# EAGLE design lcdboard (EAGLE 5.07)
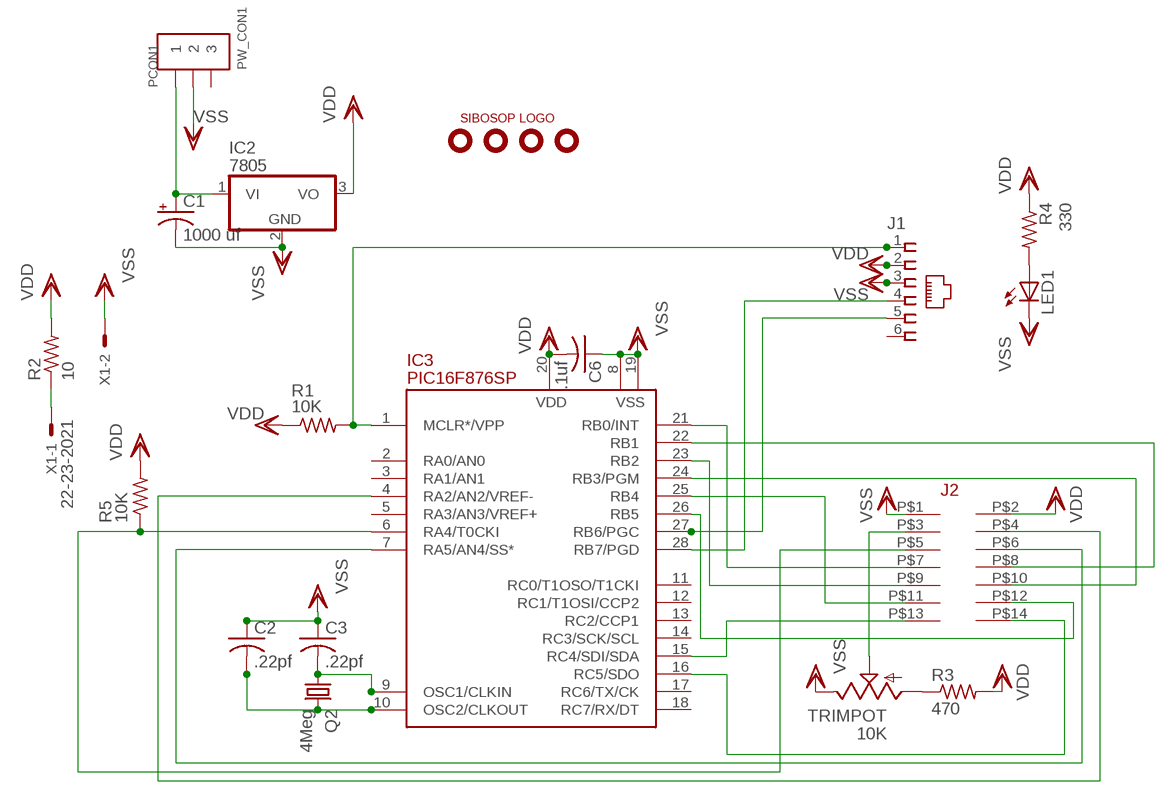
[diagram p0: schematic, sheet 1]

## Parts
10K  TRIMPOT  [RJ6S]
C1  1000 uf  CPOL-USE3.5-10  [E3,5-10]
C2  .22pf  C-US025-024X044  [C025-024X044]
C3  .22pf  C-US025-024X044  [C025-024X044]
C6  .1uf  C-US025-024X044  [C025-024X044]
IC2  7805  [TO220V]
IC3  PIC16F876SP  [DIL28-3]
J1  520250-3  [520250-3]
J2  CON-RIBBON-14  [CON-RIBBON-14]
LED1  LEDSQR2X5  [LED2X5]
PCON1  PW_CON1  [PW_CON1]
Q2  4Meg  CRYSTALHC49S  [HC49/S]
R1  10K  R-US_0204/2V  [0204V]
R2  10  R-US_0207/10  [0207/10]
R3  470  R-US_0204/7  [0204/7]
R4  330  R-US_0204/2V  [0204V]
R5  10K  R-US_0204/2V  [0204V]
U$1  HOLE-125  [HOLE-125]
U$2  HOLE-125  [HOLE-125]
U$3  LOGO  [LOGO]
U$5  HOLE-125  [HOLE-125]
U$7  HOLE-125  [HOLE-125]
X1  22-23-2021  [22-23-2021]

## Nets
N$1: IC3.1(MCLR*/VPP) J1.1 R1.2
N$2: C1.+ IC2.1(VI) PCON1.P$1
N$3: C2.2 IC3.10(OSC2/CLKOUT) Q2.2
N$4: C3.2 IC3.9(OSC1/CLKIN) Q2.1
N$5: R2.1 X1.1
N$6: 10K.A R3.1
N$7: 10K.S J2.P$3
N$8: IC3.4(RA2/AN2/VREF-) J2.P$4
N$9: IC3.6(RA4/T0CKI) J2.P$5 R5.1
N$10: IC3.7(RA5/AN4/SS*) J2.P$6
N$11: IC3.21(RB0/INT) J2.P$7
N$12: IC3.22(RB1) J2.P$8
N$13: IC3.23(RB2) J2.P$9
N$14: IC3.27(RB6/PGC) J1.5
N$15: IC3.24(RB3/PGM) J2.P$10
N$16: IC3.25(RB4) J2.P$11
N$17: IC3.26(RB5) J2.P$12
N$18: IC3.15(RC4/SDI/SDA) J2.P$13
N$19: IC3.16(RC5/SDO) J2.P$14
N$21: IC3.28(RB7/PGD) J1.4
N$22: LED1.A R4.2
VDD: C6.2 IC2.3(VO) IC3.20(VDD) J1.2 J2.P$2 R1.1 R2.2 R3.2 R4.1 R5.2
VSS: 10K.E C1.- C2.1 C3.1 C6.1 IC2.2(GND) IC3.8(VSS) IC3.19(VSS) J1.3 J2.P$1 LED1.K(C) PCON1.P$2 X1.2
Unconnected: IC3.2(RA0/AN0) IC3.3(RA1/AN1) IC3.5(RA3/AN3/VREF+) IC3.11(RC0/T1OSO/T1CKI) IC3.12(RC1/T1OSI/CCP2) IC3.13(RC2/CCP1) IC3.14(RC3/SCK/SCL) IC3.17(RC6/TX/CK) IC3.18(RC7/RX/DT) J1.6 PCON1.P$3

## Library data of the parts
10K = sibosop:TRIMPOT
C1 = rcl:CPOL-US: POLARIZED CAPACITOR, American symbol
C2 C3 C6 = rcl:C-US: CAPACITOR, American symbol
IC2 = kmarx1:78*: 78xx Family - Positive voltage regulator
IC3 = pic16f87x:PIC16F876: FLASH MICROCONTROLLER
J1 = con-amp:520250-3: AMP connector
J2 = sibosop:CON-RIBBON-14
LED1 = led:LED: LED OSRAM: - CHIPLED LG R971, LG N971, LY N971, LG Q971, LY Q971, LO R971, LY R971 LH N974, LH R974 LS Q976, LO Q976, LY Q976 LO Q996 - Hyper CHIPLED LW Q18S LB Q993, LB Q99A, LB R99A - SideLED LS A670, LO A670, LY A670, LG A670, LP A670 LB A673, LV A673, LT A673, LW A673 LH A674 LY A675 LS A676, LA A676, LO A676, LY A676, LW A676 LS A679, LY A679, LG A679 - Hyper Micro SIDELED® LS Y876, LA Y876, LO Y876, LY Y876 LT Y87S - SmartLED LW L88C, LW L88S LB L89C, LB L89S, LG L890 LS L89K, LO L89K, LY L89K LS L896, LA L896, LO L896, LY L896 - TOPLED LS T670, LO T670, LY T670, LG T670, LP T670 LSG T670, LSP T670, LSY T670, LOP T670, LYG T670 LG T671, LOG T671, LSG T671 LB T673, LV T673, LT T673, LW T673 LH T674 LS T676, LA T676, LO T676, LY T676, LB T676, LH T676, LSB T676, LW T676 LB T67C, LV T67C, LT T67C, LS T67K, LO T67K, LY T67K, LW E67C LS E67B, LA E67B, LO E67B, LY E67B, LB E67C, LV E67C, LT E67C LW T67C LS T679, LY T679, LG T679 LS T770, LO T770, LY T770, LG T770, LP T770 LB T773, LV T773, LT T773, LW T773 LH T774 LS E675, LA E675, LY E675, LS T675 LS T776, LA T776, LO T776, LY T776, LB T776 LHGB T686 LT T68C, LB T68C - Hyper Mini TOPLED® LB M676 - Mini TOPLED Santana® LG M470 LS M47K, LO M47K, LY M47K Source: http://www.osram.convergy.de - LUMILED® LXK2-PW12-R00, LXK2-PW12-S00, LXK2-PW14-U00, LXK2-PW14-V00 LXK2-PM12-R00, LXK2-PM12-S00, LXK2-PM14-U00 LXK2-PE12-Q00, LXK2-PE12-R00, LXK2-PE12-S00, LXK2-PE14-T00, LXK2-PE14-U00 LXK2-PB12-K00, LXK2-PB12-L00, LXK2-PB12-M00, LXK2-PB14-N00, LXK2-PB14-P00, LXK2-PB14-Q00 LXK2-PR12-L00, LXK2-PR12-M00, LXK2-PR14-Q00, LXK2-PR14-R00 LXK2-PD12-Q00, LXK2-PD12-R00, LXK2-PD12-S00 LXK2-PH12-R00, LXK2-PH12-S00 LXK2-PL12-P00, LXK2-PL12-Q00, LXK2-PL12-R00 Source: www.luxeon.com
PCON1 = powerconnectorskt:PW_CON1
Q2 = crystal:CRYSTAL: CRYSTAL
R1-R5 = rcl:R-US_: RESISTOR, American symbol
U$1 U$2 U$5 U$7 = sibosop:HOLE-125
U$3 = sibosop:LOGO
X1 = sibosop-con-molex:22-23-2021: .100" (2.54mm) Center Header - 2 Pin

## Board
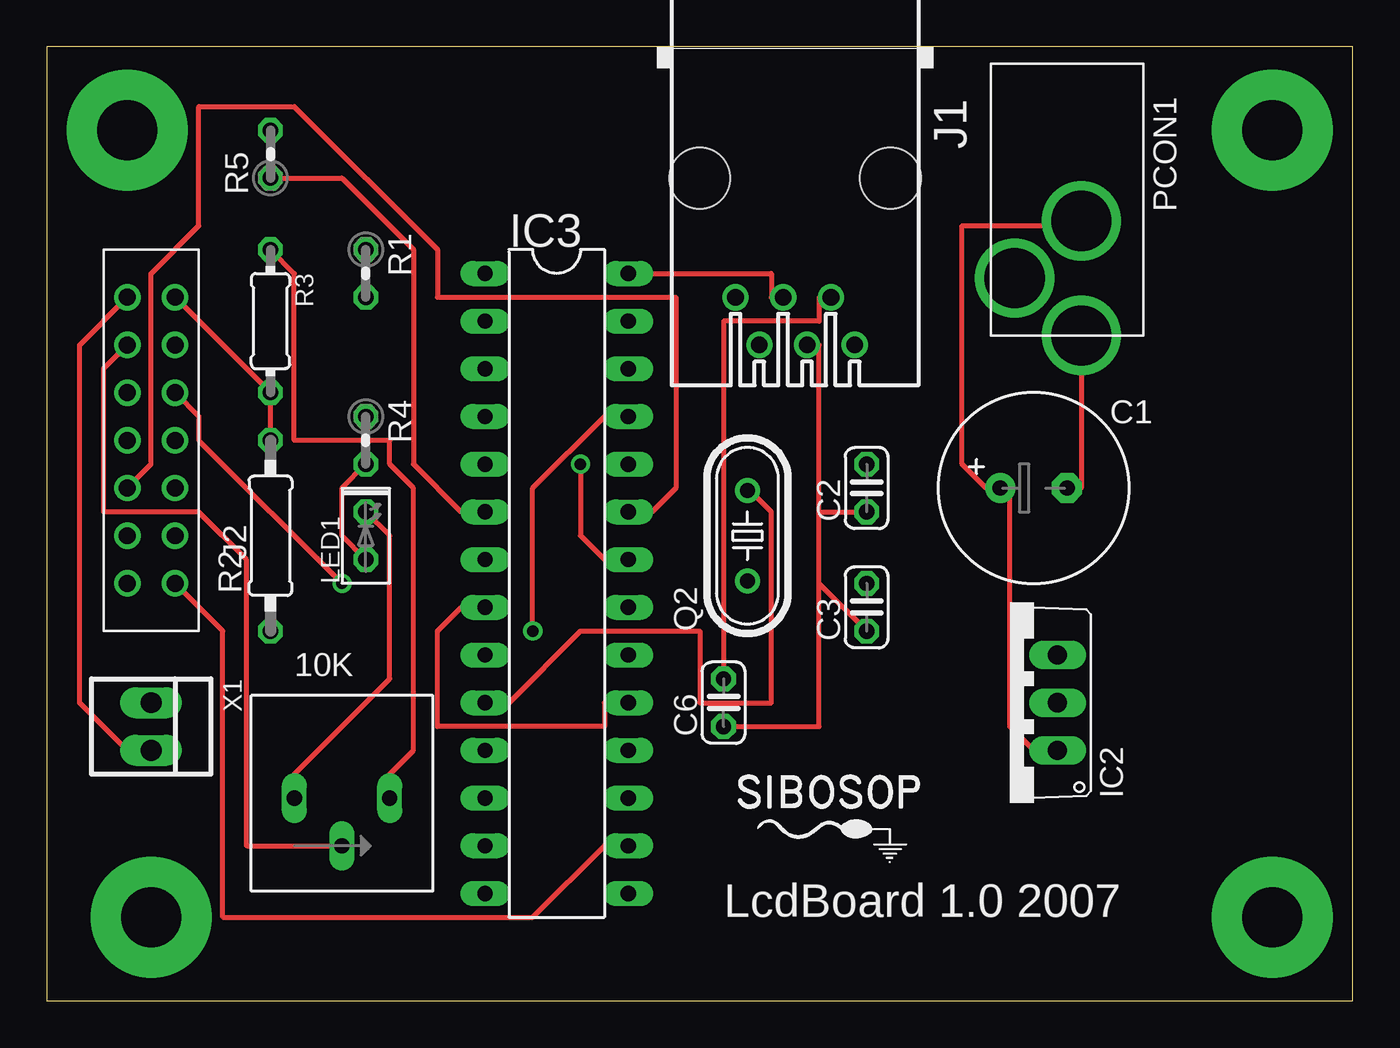
[diagram p1: board, top side]
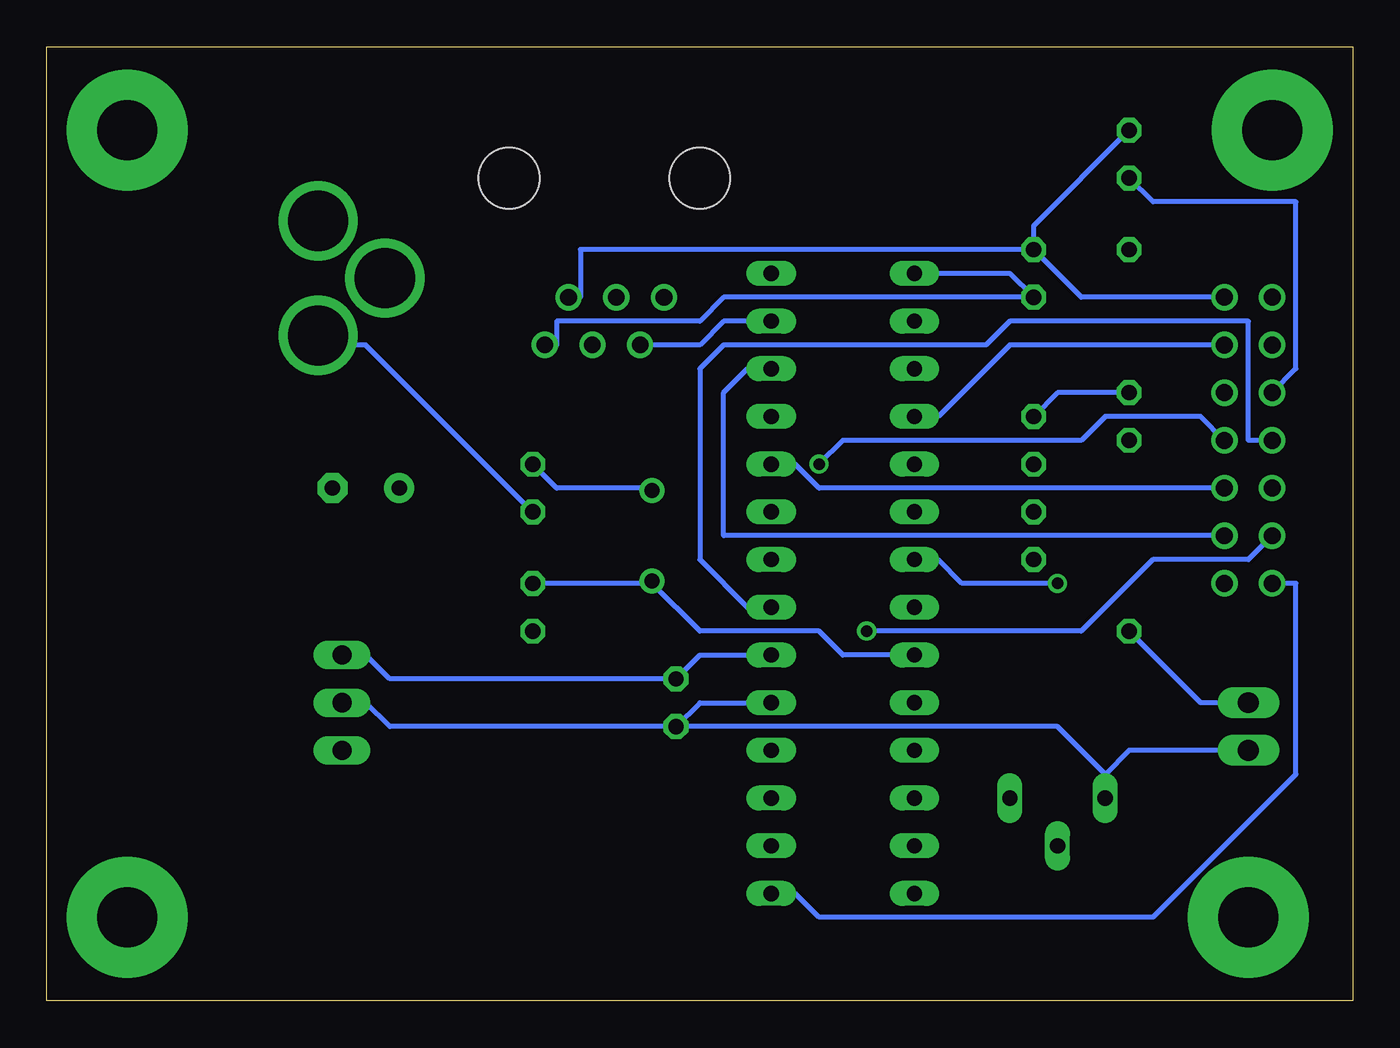
[diagram p2: board, bottom side, seen from below]

Size 69.52 x 50.79 mm. Coordinates in mm from the lower left corner, seen from the top.
Outline: 0,0 69.52,0 69.52,50.79 0,50.79 0,0
Copper layers (1*16): Top 0.035mm / dielectric 1.5mm / Bottom 0.035mm
Design rules "default": minimum track width 10mil, minimum drill 24mil, track to track 8mil, track to pad 8mil, pad to pad 8mil, via to via 8mil, smd to smd 8mil, copper to edge 40mil, drill to drill 8mil, minimum pad ring 10mil, minimum via ring 8mil, stop-mask expansion 4mil, vias tented up to drill 0mil, thermal gap 10mil

### Footprints (pad centres in the part's own frame; a part is rotated, then mirrored left to right if it is on the bottom)
RJ6S = drill 0.813 long: A 2.54,0; E -2.54,0; S 0,-2.54
E3,5-10 = drill 0.813 pad 1.6 round: + -1.778,0 | drill 0.813 pad 1.6 octagon: - 1.778,0
C025-024X044 = drill 0.813 octagon: 1 -1.27,0; 2 1.27,0
TO220V = drill 1.016 long: 1 -2.54,0; 2 0,0; 3 2.54,0
DIL28-3 = drill 0.813 long: 1 -16.51,-3.81; 2 -13.97,-3.81; 3 -11.43,-3.81; 4 -8.89,-3.81; 5 -6.35,-3.81; 6 -3.81,-3.81; 7 -1.27,-3.81; 8 1.27,-3.81; 9 3.81,-3.81; 10 6.35,-3.81; 11 8.89,-3.81; 12 11.43,-3.81; 13 13.97,-3.81; 14 16.51,-3.81; 15 16.51,3.81; 16 13.97,3.81; 17 11.43,3.81; 18 8.89,3.81; 19 6.35,3.81; 20 3.81,3.81; 21 1.27,3.81; 22 -1.27,3.81; 23 -3.81,3.81; 24 -6.35,3.81; 25 -8.89,3.81; 26 -11.43,3.81; 27 -13.97,3.81; 28 -16.51,3.81
520250-3 = drill 0.889 round: 1 -3.175,8.89; 2 -1.905,6.35; 3 -0.635,8.89; 4 0.635,6.35; 5 1.905,8.89; 6 3.175,6.35 | hole 3.251: -5.08,0; 5.08,0
CON-RIBBON-14 = drill 0.9 round: P$1 -2.54,7.62; P$2 0,7.62; P$3 -2.54,5.08; P$4 0,5.08; P$5 -2.54,2.54; P$6 0,2.54; P$7 -2.54,0; P$8 0,0; P$9 -2.54,-2.54; P$10 0,-2.54; P$11 -2.54,-5.08; P$12 0,-5.08; P$13 -2.54,-7.62; P$14 0,-7.62
LED2X5 = drill 0.813 octagon: A -1.27,0; K 1.27,0
PW_CON1 = drill 3.2 pad 3.81 round: P$1 -0.254,0; P$2 5.842,0; P$3 2.794,-3.556
HC49/S = drill 0.813 round: 1 -2.413,0; 2 2.413,0
0204V = drill 0.813 octagon: 1 -1.27,0; 2 1.27,0
0207/10 = drill 0.813 octagon: 1 -5.08,0; 2 5.08,0
0204/7 = drill 0.813 octagon: 1 -3.81,0; 2 3.81,0
HOLE-125 = drill 3.2 pad 6.452 round: P$1 0,0
22-23-2021 = drill 1.1 long: 1 -1.27,0; 2 1.27,0

### Placement (x,y rotation side)
10K  15.71,10.79 0 top
C1  52.54,27.3 0 top
C2  43.65,27.3 90 top
C3  43.65,20.95 90 top
C6  36.03,15.87 90 top
IC2  53.81,15.87 90 top
IC3  27.14,22.22 270 top
J1  39.84,43.81 180 top
J2  6.82,29.84 0 top
LED1  16.98,24.76 90 top
PCON1  55.08,41.27 270 top
Q2  37.3,24.76 90 top
R1  16.98,38.73 270 top
R2  11.9,24.76 90 top
R3  11.9,36.19 270 top
R4  16.98,29.84 270 top
R5  11.9,45.08 90 top
U$1  5.55,4.44 0 top
U$2  4.28,46.35 0 top
U$3  41.11,10.79 0 top
U$5  65.24,46.35 0 top
U$7  65.24,4.44 0 top
X1  5.55,14.6 270 top

### Tracks (layer width: path | path; a pad name or v marks a point on that pad's centre or on a via)
N$1
  Bottom 0.254: IC3.1 18.25,38.73 R1.2 33.49,37.46 34.76,36.19 42.38,36.19 42.38,34.92 J1.1
N$2
  Top 0.254: IC2.1 52.54,13.33 51.27,14.6 51.27,27.3 C1.+ 50,27.3 48.73,28.57 48.73,41.27 53.81,41.27 PCON1.P$1
N$3
  Top 0.254: IC3.10 24.6,15.87 28.41,19.68 34.76,19.68 34.76,15.87 38.57,15.87 38.57,26.03 37.3,27.3 Q2.2
  Bottom 0.254: C2.2 42.38,27.3 37.3,27.3 Q2.2
N$4
  Bottom 0.254: 37.3,22.22 34.76,19.68 28.41,19.68 27.14,18.41 IC3.9 | 37.3,22.22 C3.2 | 37.3,22.22 Q2.1
N$5
  Bottom 0.254: R2.1 8.09,15.87 X1.1
N$6
  Top 0.254: R3.1 13.17,38.73 13.17,29.84 18.25,29.84 18.25,28.57 19.52,27.3 19.52,13.33 18.25,12.06 10K.A
N$7
  Top 0.254: 10K.S 10.63,8.25 10.63,23.49 8.09,26.03 3.01,26.03 3.01,33.65 J2.P$3
N$8
  Bottom 0.254: J2.P$4 18.25,34.92 22.06,31.11 IC3.4
N$9
  Top 0.254: R5.1 15.71,43.81 19.52,40 19.52,28.57 22.06,26.03 IC3.6
  Bottom 0.254: J2.P$5 3.01,33.65 3.01,42.54 10.63,42.54 R5.1
N$10  (via drill 0.61)
  Top 0.254: v15.71,22.22 8.09,29.84 8.09,31.11 J2.P$6
  Bottom 0.254: v15.71,22.22 20.79,22.22 22.06,23.49 IC3.7
N$11
  Bottom 0.254: J2.P$7 5.55,29.84 5.55,36.19 18.25,36.19 19.52,34.92 33.49,34.92 34.76,33.65 34.76,23.49 32.22,20.95 IC3.21
N$12  (via drill 0.61)
  Top 0.254: v28.41,28.57 28.41,24.76 29.68,23.49 IC3.22
  Bottom 0.254: v28.41,28.57 27.14,29.84 14.44,29.84 13.17,31.11 8.09,31.11 J2.P$8
N$13
  Top 0.254: J2.P$9 5.55,28.57 5.55,38.73 8.09,41.27 8.09,47.62 13.17,47.62 20.79,40 20.79,37.46 33.49,37.46 33.49,27.3 32.22,26.03 IC3.23
N$14
  Bottom 0.254: IC3.27 33.49,36.19 34.76,34.92 J1.5
N$15
  Bottom 0.254: J2.P$10 28.41,27.3 29.68,28.57 IC3.24
N$16  (via drill 0.61)
  Top 0.254: v25.87,19.68 25.87,27.3 29.68,31.11 IC3.25
  Bottom 0.254: v25.87,19.68 14.44,19.68 10.63,23.49 5.55,23.49 J2.P$11
N$17
  Bottom 0.254: J2.P$12 33.49,24.76 33.49,32.38 32.22,33.65 IC3.26
N$18
  Bottom 0.254: J2.P$13 3.01,22.22 3.01,12.06 10.63,4.44 28.41,4.44 29.68,5.71 IC3.15
N$19
  Top 0.254: J2.P$14 9.36,19.68 9.36,4.44 25.87,4.44 29.68,8.25 IC3.16
N$21
  Top 0.254: IC3.28 38.57,38.73 38.57,37.46 J1.4
N$22
  Top 0.254: LED1.A 15.71,24.76 15.71,27.3 R4.2
VDD
  Top 0.254: R2.2 R3.2 J2.P$2 | C6.2 36.03,36.19 41.11,36.19 41.11,37.46 J1.2
  Bottom 0.254: IC3.20 34.76,18.41 C6.2 51.27,17.14 52.54,18.41 IC2.3 | R4.1 15.71,32.38 R3.2 | R1.1 14.44,37.46 J2.P$2 | R5.2 16.98,41.27 R1.1 | R1.1 41.11,40 41.11,37.46 J1.2
VSS
  Top 0.254: LED1.K 18.25,24.76 18.25,17.14 13.17,12.06 10K.E | J2.P$1 1.74,34.92 1.74,15.87 4.28,13.33 X1.2 | IC3.8 22.06,20.95 20.79,19.68 20.79,14.6 29.68,14.6 29.68,15.87 IC3.19 | 41.11,22.22 C3.1 | 41.11,26.03 41.11,34.92 J1.3 | 41.11,22.22 41.11,26.03 | 41.11,26.03 C2.1 | C1.- 55.08,27.3 PCON1.P$2 | C6.1 41.11,14.6 41.11,22.22
  Bottom 0.254: 13.17,12.06 11.9,13.33 X1.2 | C6.1 34.76,15.87 IC3.19 | C6.1 51.27,14.6 52.54,15.87 IC2.2 | C2.1 52.54,34.92 53.81,34.92 PCON1.P$2 | 13.17,12.06 15.71,14.6 C6.1 | 13.17,12.06 10K.E

### Text on the board
tNames: LcdBoard 1.0 2007